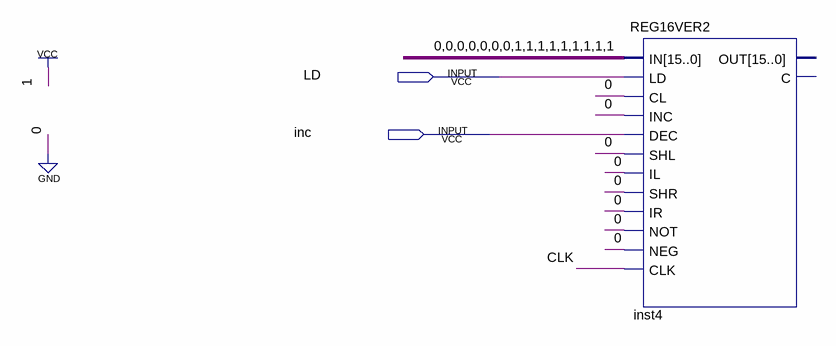
[diagram p0: schematic sheet]
// Quartus schematic Test.bdf as structural Verilog: 1 symbols, 2 pins
module Test (
  input  LD,
  input  inc
);

  wire CLK;

  REG16VER2 inst4 (
    .IN(16'b0000000111111111), .LD(LD), .CL(1'b0), .INC(1'b0), .DEC(inc), .SHL(1'b0), .IL(1'b0), .SHR(1'b0),
    .IR(1'b0), .NOT(1'b0), .NEG(1'b0), .CLK(CLK));  // open: OUT, C
endmodule
